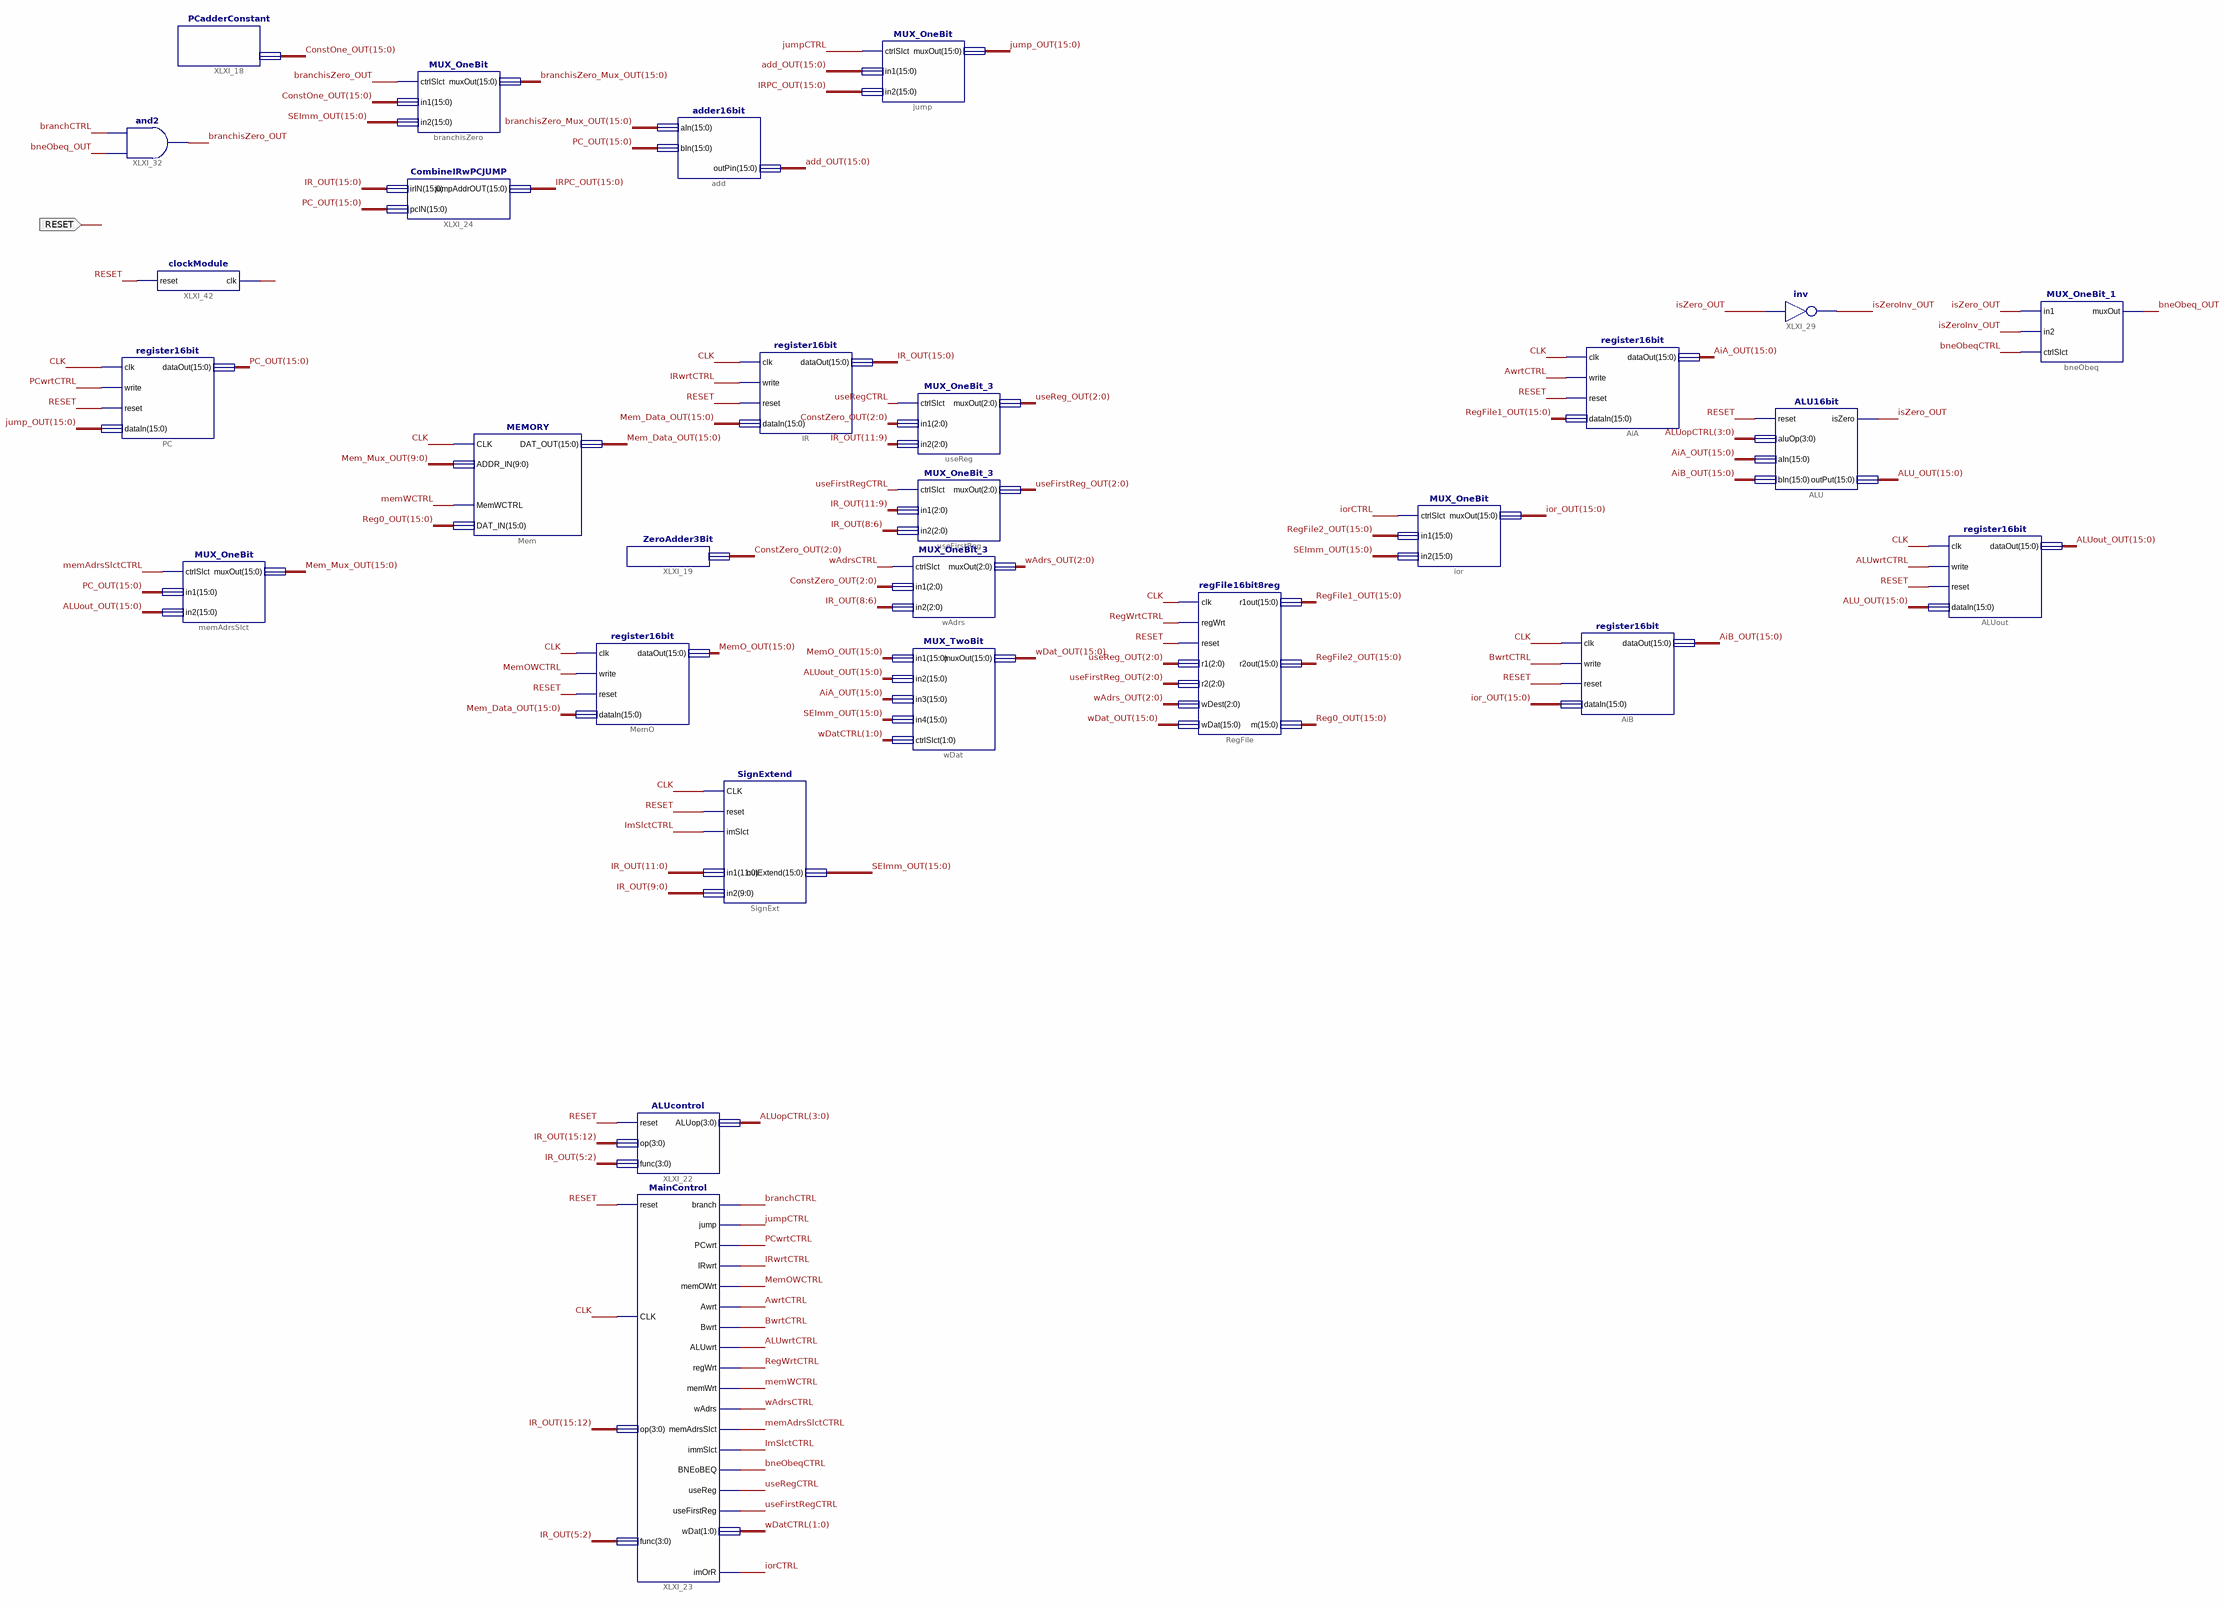
[diagram p0: schematic sheet 1]
// Xilinx ISE schematic EverythingV2.sch (spartan3e) as structural Verilog: 28 symbols, 1 ports
module EverythingV2 (
  input  RESET
);

  wire ALUwrtCTRL, AwrtCTRL, bneObeq_OUT, bneObeqCTRL, branchCTRL, branchisZero_OUT, BwrtCTRL, CLK,
       ImSlctCTRL, iorCTRL, IRwrtCTRL, isZero_OUT, isZeroInv_OUT, jumpCTRL, memAdrsSlctCTRL, MemOWCTRL,
       memWCTRL, PCwrtCTRL, RegWrtCTRL, useFirstRegCTRL, useRegCTRL, wAdrsCTRL;
  wire [1:0] wDatCTRL;
  wire [2:0] ConstZero_OUT, useFirstReg_OUT, useReg_OUT, wAdrs_OUT;
  wire [3:0] ALUopCTRL;
  wire [15:0] add_OUT, AiA_OUT, AiB_OUT, ALU_OUT, ALUout_OUT, branchisZero_Mux_OUT, ConstOne_OUT, ior_OUT,
       IR_OUT, IRPC_OUT, jump_OUT, Mem_Data_OUT, Mem_Mux_OUT, MemO_OUT, PC_OUT, Reg0_OUT, RegFile1_OUT,
       RegFile2_OUT, SEImm_OUT, wDat_OUT;

  register16bit IR (.clk(CLK), .write(IRwrtCTRL), .reset(RESET), .dataIn(Mem_Data_OUT), .dataOut(IR_OUT));
  MEMORY Mem (.CLK(CLK), .ADDR_IN(Mem_Mux_OUT[9:0]), .MemWCTRL(memWCTRL), .DAT_OUT(Mem_Data_OUT), .DAT_IN(Reg0_OUT));
  MUX_OneBit_3 useReg (.ctrlSlct(useRegCTRL), .in1(ConstZero_OUT), .in2(IR_OUT[11:9]), .muxOut(useReg_OUT));
  MUX_OneBit_3 useFirstReg (
    .ctrlSlct(useFirstRegCTRL), .in1(IR_OUT[11:9]), .in2(IR_OUT[8:6]), .muxOut(useFirstReg_OUT));
  MUX_OneBit_3 wAdrs (.ctrlSlct(wAdrsCTRL), .in1(ConstZero_OUT), .in2(IR_OUT[8:6]), .muxOut(wAdrs_OUT));
  MUX_TwoBit wDat (
    .in1(MemO_OUT), .in2(ALUout_OUT), .in3(AiA_OUT), .in4(SEImm_OUT), .ctrlSlct(wDatCTRL), .muxOut(wDat_OUT));
  MUX_OneBit_1 bneObeq (.in1(isZero_OUT), .in2(isZeroInv_OUT), .ctrlSlct(bneObeqCTRL), .muxOut(bneObeq_OUT));
  ALU16bit ALU (.reset(RESET), .aluOp(ALUopCTRL), .aIn(AiA_OUT), .bIn(AiB_OUT), .isZero(isZero_OUT), .outPut(ALU_OUT));
  MUX_OneBit branchisZero (
    .ctrlSlct(branchisZero_OUT), .in1(ConstOne_OUT), .in2(SEImm_OUT), .muxOut(branchisZero_Mux_OUT));
  PCadderConstant XLXI_18 (.constantOne(ConstOne_OUT));
  MUX_OneBit jump (.ctrlSlct(jumpCTRL), .in1(add_OUT), .in2(IRPC_OUT), .muxOut(jump_OUT));
  ALUcontrol XLXI_22 (.reset(RESET), .op(IR_OUT[15:12]), .func(IR_OUT[5:2]), .ALUop(ALUopCTRL));
  MainControl XLXI_23 (
    .reset(RESET), .CLK(CLK), .op(IR_OUT[15:12]), .func(IR_OUT[5:2]), .branch(branchCTRL), .jump(jumpCTRL),
    .PCwrt(PCwrtCTRL), .IRwrt(IRwrtCTRL), .memOWrt(MemOWCTRL), .Awrt(AwrtCTRL), .Bwrt(BwrtCTRL),
    .ALUwrt(ALUwrtCTRL), .regWrt(RegWrtCTRL), .memWrt(memWCTRL), .wAdrs(wAdrsCTRL),
    .memAdrsSlct(memAdrsSlctCTRL), .immSlct(ImSlctCTRL), .BNEoBEQ(bneObeqCTRL), .useReg(useRegCTRL),
    .useFirstReg(useFirstRegCTRL), .wDat(wDatCTRL), .imOrR(iorCTRL));
  CombineIRwPCJUMP XLXI_24 (.irIN(IR_OUT), .pcIN(PC_OUT), .jumpAddrOUT(IRPC_OUT));
  register16bit PC (.clk(CLK), .write(PCwrtCTRL), .reset(RESET), .dataIn(jump_OUT), .dataOut(PC_OUT));
  adder16bit add (.aIn(branchisZero_Mux_OUT), .bIn(PC_OUT), .outPin(add_OUT));
  not XLXI_29 (isZeroInv_OUT, isZero_OUT);
  and XLXI_32 (branchisZero_OUT, bneObeq_OUT, branchCTRL);
  register16bit MemO (.clk(CLK), .write(MemOWCTRL), .reset(RESET), .dataIn(Mem_Data_OUT), .dataOut(MemO_OUT));
  ZeroAdder3Bit XLXI_19 (.constantZero(ConstZero_OUT));
  SignExtend SignExt (
    .CLK(CLK), .reset(RESET), .imSlct(ImSlctCTRL), .in1(IR_OUT[11:0]), .in2(IR_OUT[9:0]),
    .outExtend(SEImm_OUT));
  register16bit AiA (.clk(CLK), .write(AwrtCTRL), .reset(RESET), .dataIn(RegFile1_OUT), .dataOut(AiA_OUT));
  register16bit AiB (.clk(CLK), .write(BwrtCTRL), .reset(RESET), .dataIn(ior_OUT), .dataOut(AiB_OUT));
  MUX_OneBit ior (.ctrlSlct(iorCTRL), .in1(RegFile2_OUT), .in2(SEImm_OUT), .muxOut(ior_OUT));
  regFile16bit8reg RegFile (
    .clk(CLK), .regWrt(RegWrtCTRL), .reset(RESET), .r1(useReg_OUT), .r2(useFirstReg_OUT), .wDest(wAdrs_OUT),
    .wDat(wDat_OUT), .r1out(RegFile1_OUT), .r2out(RegFile2_OUT), .m(Reg0_OUT));
  clockModule XLXI_42 (.reset(RESET), .clk(CLK));
  MUX_OneBit memAdrsSlct (.ctrlSlct(memAdrsSlctCTRL), .in1(PC_OUT), .in2(ALUout_OUT), .muxOut(Mem_Mux_OUT));
  register16bit ALUout (.clk(CLK), .write(ALUwrtCTRL), .reset(RESET), .dataIn(ALU_OUT), .dataOut(ALUout_OUT));
endmodule
